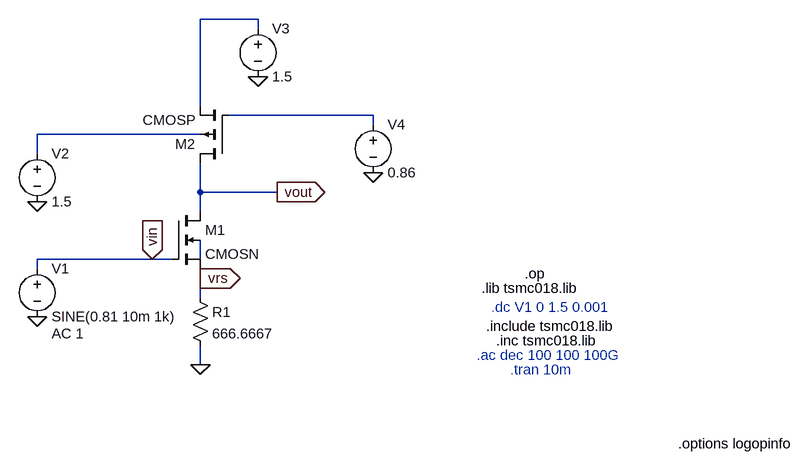
[diagram p0: schematic Exp-2a.asc]
Exp-2a.asc, the LTspice schematic file:
Version 4.1
SHEET 1 3292 824
WIRE 240 -128 144 -128
WIRE 240 -112 240 -128
WIRE 144 16 144 -128
WIRE 432 32 192 32
WIRE 432 48 432 32
WIRE 144 64 -128 64
WIRE -128 96 -128 64
WIRE 144 160 144 112
WIRE 272 160 144 160
WIRE 144 192 144 160
WIRE 64 272 -128 272
WIRE 96 272 64 272
WIRE 144 272 144 240
WIRE -128 288 -128 272
WIRE 144 304 144 288
WIRE 144 336 144 304
WIRE 144 448 144 416
FLAG 144 448 0
FLAG -128 176 0
FLAG -128 368 0
FLAG 432 128 0
FLAG 240 -32 0
FLAG 272 160 vout
IOPIN 272 160 Out
FLAG 64 272 vin
IOPIN 64 272 In
FLAG 144 304 vrs
IOPIN 144 304 Out
SYMBOL nmos4 96 192 R0
SYMATTR InstName M1
SYMATTR Value CMOSN
SYMATTR Value2 l=180n w=15.3u
SYMBOL pmos4 192 112 R180
SYMATTR InstName M2
SYMATTR Value CMOSP
SYMATTR Value2 l=180n w=56.35u
SYMBOL res 128 320 R0
SYMATTR InstName R1
SYMATTR Value 666.6667
SYMBOL voltage -128 272 R0
WINDOW 123 24 124 Left 2
WINDOW 39 0 0 Left 0
SYMATTR Value2 AC 1
SYMATTR InstName V1
SYMATTR Value SINE(0.81 10m 1k)
SYMBOL voltage -128 80 R0
WINDOW 123 0 0 Left 0
WINDOW 39 0 0 Left 0
SYMATTR InstName V2
SYMATTR Value 1.5
SYMBOL voltage 240 -128 R0
WINDOW 123 0 0 Left 0
WINDOW 39 0 0 Left 0
SYMATTR InstName V3
SYMATTR Value 1.5
SYMBOL voltage 432 32 R0
WINDOW 123 0 0 Left 0
WINDOW 39 0 0 Left 0
SYMATTR InstName V4
SYMATTR Value 0.86
TEXT 1176 320 Left 2 !.lib tsmc018.lib
TEXT 1248 296 Left 2 !.op
TEXT 1184 384 Left 2 !.include tsmc018.lib
TEXT 1200 408 Left 2 !.inc tsmc018.lib
TEXT 1192 352 Left 2 ;.dc V1 0 1.5 0.001
TEXT 1224 456 Left 2 ;.tran 10m
TEXT 1168 432 Left 2 ;.ac dec 100 100 100G
TEXT 3080 808 Left 2 !.options logopinfo

The netlist it stands for:
* Exp-2a.asc
M1 vout vin vrs N004 CMOSN l=180n w=15.3u
M2 vout N002 N001 N003 CMOSP l=180n w=56.35u
R1 vrs 0 666.6667
V1 vin 0 SINE(0.81 10m 1k) AC 1
V2 N003 0 1.5
V3 N001 0 1.5
V4 N002 0 0.86
.model NMOS NMOS
.model PMOS PMOS
.lib standard.mos
.lib tsmc018.lib
.op
.include tsmc018.lib
.inc tsmc018.lib
* .dc V1 0 1.5 0.001
* .tran 10m
* .ac dec 100 100 100G
.options logopinfo
.backanno
.end